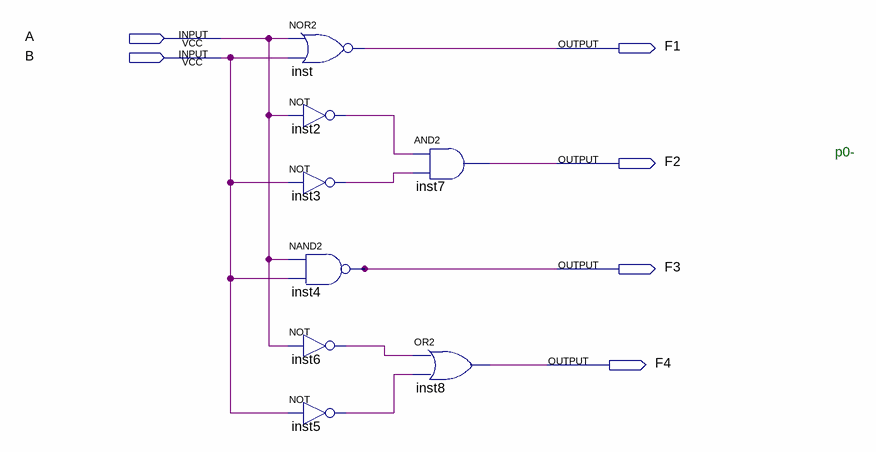
[diagram p0: schematic sheet]
// Quartus schematic 913002.bdf as structural Verilog: 8 symbols, 6 pins
module \913002  (
  input  A,
  input  B,
  output F1,
  output F2,
  output F3,
  output F4
);

  wire inst2_out, inst3_out, inst5_out, inst6_out;

  nor inst (F1, A, B);
  not inst2 (inst2_out, A);
  not inst3 (inst3_out, B);
  nand inst4 (F3, A, B);
  not inst6 (inst6_out, A);
  not inst5 (inst5_out, B);
  and inst7 (F2, inst2_out, inst3_out);
  or inst8 (F4, inst6_out, inst5_out);

  // Notes on the sheet:
  //   p0-
endmodule
